# Altium schematic sheet motordriver-v3.1_power-stage.SchDoc
size A
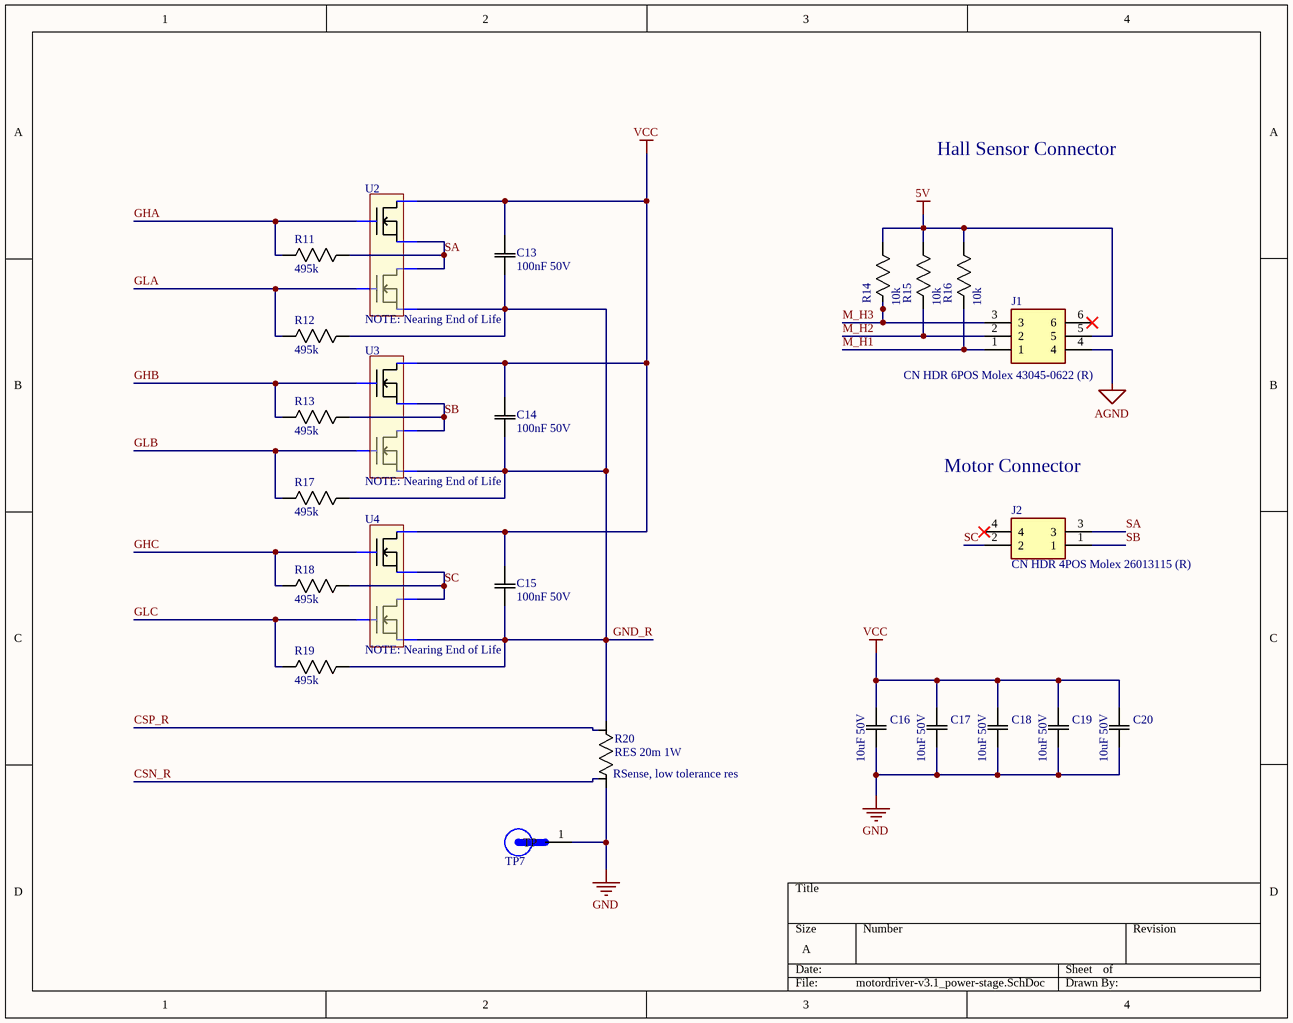
[diagram p0: motordriver-v3.1_power-stage.SchDoc]

## Parts
C13  100nF 50V  [0603]
C14  100nF 50V  [0603]
C15  100nF 50V  [0603]
C16  10uF 50V  [0805]
C17  10uF 50V  [0805]
C18  10uF 50V  [0805]
C19  10uF 50V  [0805]
C20  10uF 50V  [0805]
J1  CN HDR 6POS Molex 43045-0622 (R)  [430450622]
J2  CN HDR 4POS Molex 26013115 (R)  [26013115]
R11  495k  [0603]
R12  495k  [0603]
R13  495k  [0603]
R14  10k  [0603]
R15  10k  [0603]
R16  10k  [0603]
R17  495k  [0603]
R18  495k  [0603]
R19  495k  [0603]
R20  RES 20m 1W  [1206 - Sense]
TP7  Test Point - 5019  [TP380X203]  (value not drawn)
U2  NOTE: Nearing End of Life  [PG-TDSON-8-10]
U3  NOTE: Nearing End of Life  [PG-TDSON-8-10]
U4  NOTE: Nearing End of Life  [PG-TDSON-8-10]

## Nets
5V: J1.5 R14.1(R1) R15.1(R1) R16.1(R1)
AGND: J1.4
GND: C16.2(C2) C17.2(C2) C18.2(C2) C19.2(C2) C20.2(C2) R20.2(R2) TP7.1(TP)
VCC: C13.2(C2) C14.2(C2) C15.2(C2) C16.1(C1) C17.1(C1) C18.1(C1) C19.1(C1) C20.1(C1) U2.8(D1) U3.8(D1) U4.8(D1)
CSN_R: R20.4
CSP_R: R20.3
GHA: R11.2(R2) U2.2(G1)
GHB: R13.2(R2) U3.2(G1)
GHC: R18.2(R2) U4.2(G1)
GLA: R12.2(R2) U2.4(G2)
GLB: R17.2(R2) U3.4(G2)
GLC: R19.2(R2) U4.4(G2)
GND_R: C13.1(C1) C14.1(C1) C15.1(C1) R12.1(R1) R17.1(R1) R19.1(R1) R20.1(R1) U2.3(S2) U3.3(S2) U4.3(S2)
M_H1: J1.1 R16.2(R2)
M_H2: J1.2 R15.2(R2)
M_H3: J1.3 R14.2(R2)
SA: J2.3 R11.1(R1) U2.1(S1) U2.6(D2)
SB: J2.1 R13.1(R1) U3.1(S1) U3.6(D2)
SC: J2.2 R18.1(R1) U4.1(S1) U4.6(D2)

Not connected (* = marked no-connect by the designer): J1 6*; J2 4*

## Notes on the sheet
- Hall Sensor Connector
- Motor Connector
- (near R20) RSense, low tolerance res

## Library data of the parts
C13-C15 = CAP 100nF 50V: CAP CER 0.1UF 50V X7R 0805; Tolerance: 10%; Package: 0805; Value: 100nF; Rating: 50V
C16-C20 = CAP 10uF 50V: CAP CER 10UF 50V X7R; Tolerance: 10%; Package: 1210; Value: 10uF; Rating: 50V; ComponentLink1Description: digikey; ComponentLink1URL: https://www.digikey.ca/en/products/detail/kemet/C1210C106M5RACTU/4918883
J1 = CN HDR 6POS Molex 43045-0622 (R): Molex 43045-0622 6POS Microfit / dual row, right angle
J2 = CN HDR 4POS Molex 26013115 (R): Molex 26013115 4POS Minifit / dual row, right angle
R11-R13 R17-R19 = RES 495k 1/8W: RES SMD 499K OHM 1% 1/8W 0805; Manufacturer: Yageo; Manufacturer Part Number: RC0805FR-07499KL; Temperature Coefficient: 100ppm/°C; Voltage Rating (DC): 150V; Resistance: 499kR; Power Rating: 125mW; Supplier 1: Digi-Key; RoHS: Yes; Category: Chip SMD Resistors; Stock 1: 2275; Pricing 1: 1=0.10000, 10=0.04000, 100=0.01630, 1000=0.00731, 2500=0.00635 (USD); Case/Package: 0805; Case Code (Metric): 2012; Case Code (Imperial): 0805; Contact Plating: Tin,Lead,Matte; Min Operating Temperature: -55°C; Max Operating Temperature: 155°C; Termination: SMD/SMT; Composition: Thick Film; Military Standard: Not; Tolerance: 1%; Voltage Rating: 150V; Packaging: Tape and Reel; Length: 2mm; Depth: 1.25mm; Radiation Hardening: No; Lead Free: Lead Free; ComponentLink1URL: https://datasheet.ciiva.com/15189/getdatasheetpartid-326570-15189975.pdf?src-supplier=Verical; ComponentLink1Description: https://datasheet.ciiva.com/15189/getdatasheetpartid-326570-15189975.pdf?src-supplier=Verical; Supplier Part Number 1: 311-499KCRCT-ND
R14-R16 = RES 10k 1/8W - 1%: RES SMD 10K OHM 1% 1/8W 0805; Power (Watts): 0.125W; Package: 0805; Value: 10k; Tolerance: 1%
R20 = RES 20m 1W: RES SMD 0.02 OHM 1% 1W 1206
TP7 = Test Point - 5019: PC Test Point, Miniature Phosphor Bronze, Silver Plating Surface Mount Mounting Type; MP: 5019; MF: Keystone Electronics; Value: *; Package: 2010 Keystone; Digi-Key_Part_Number: 36-5019CT-ND; Digi-Key_Purchase_URL: https://www.digikey.com/product-detail/en/keystone-electronics/5019/36-5019CT-ND/3907344?utm_source=snapeda&utm_medium=aggregator&utm_campaign=symbol
U2-U4 = MOSFET IPG20N06S4-15A: MOSFET N+N 60V 20A; MF: Infineon Technologies; MF P/N: IPG20N06S4-15A; Supplier 1: Mouser; Supplier Part Number 1: 726-IPG20N06S415ATMA